# EAGLE design Bluelight (EAGLE 7.6.0)
DESIGNER: J. Gordon

## Sheet 1 of 4: SAMD21
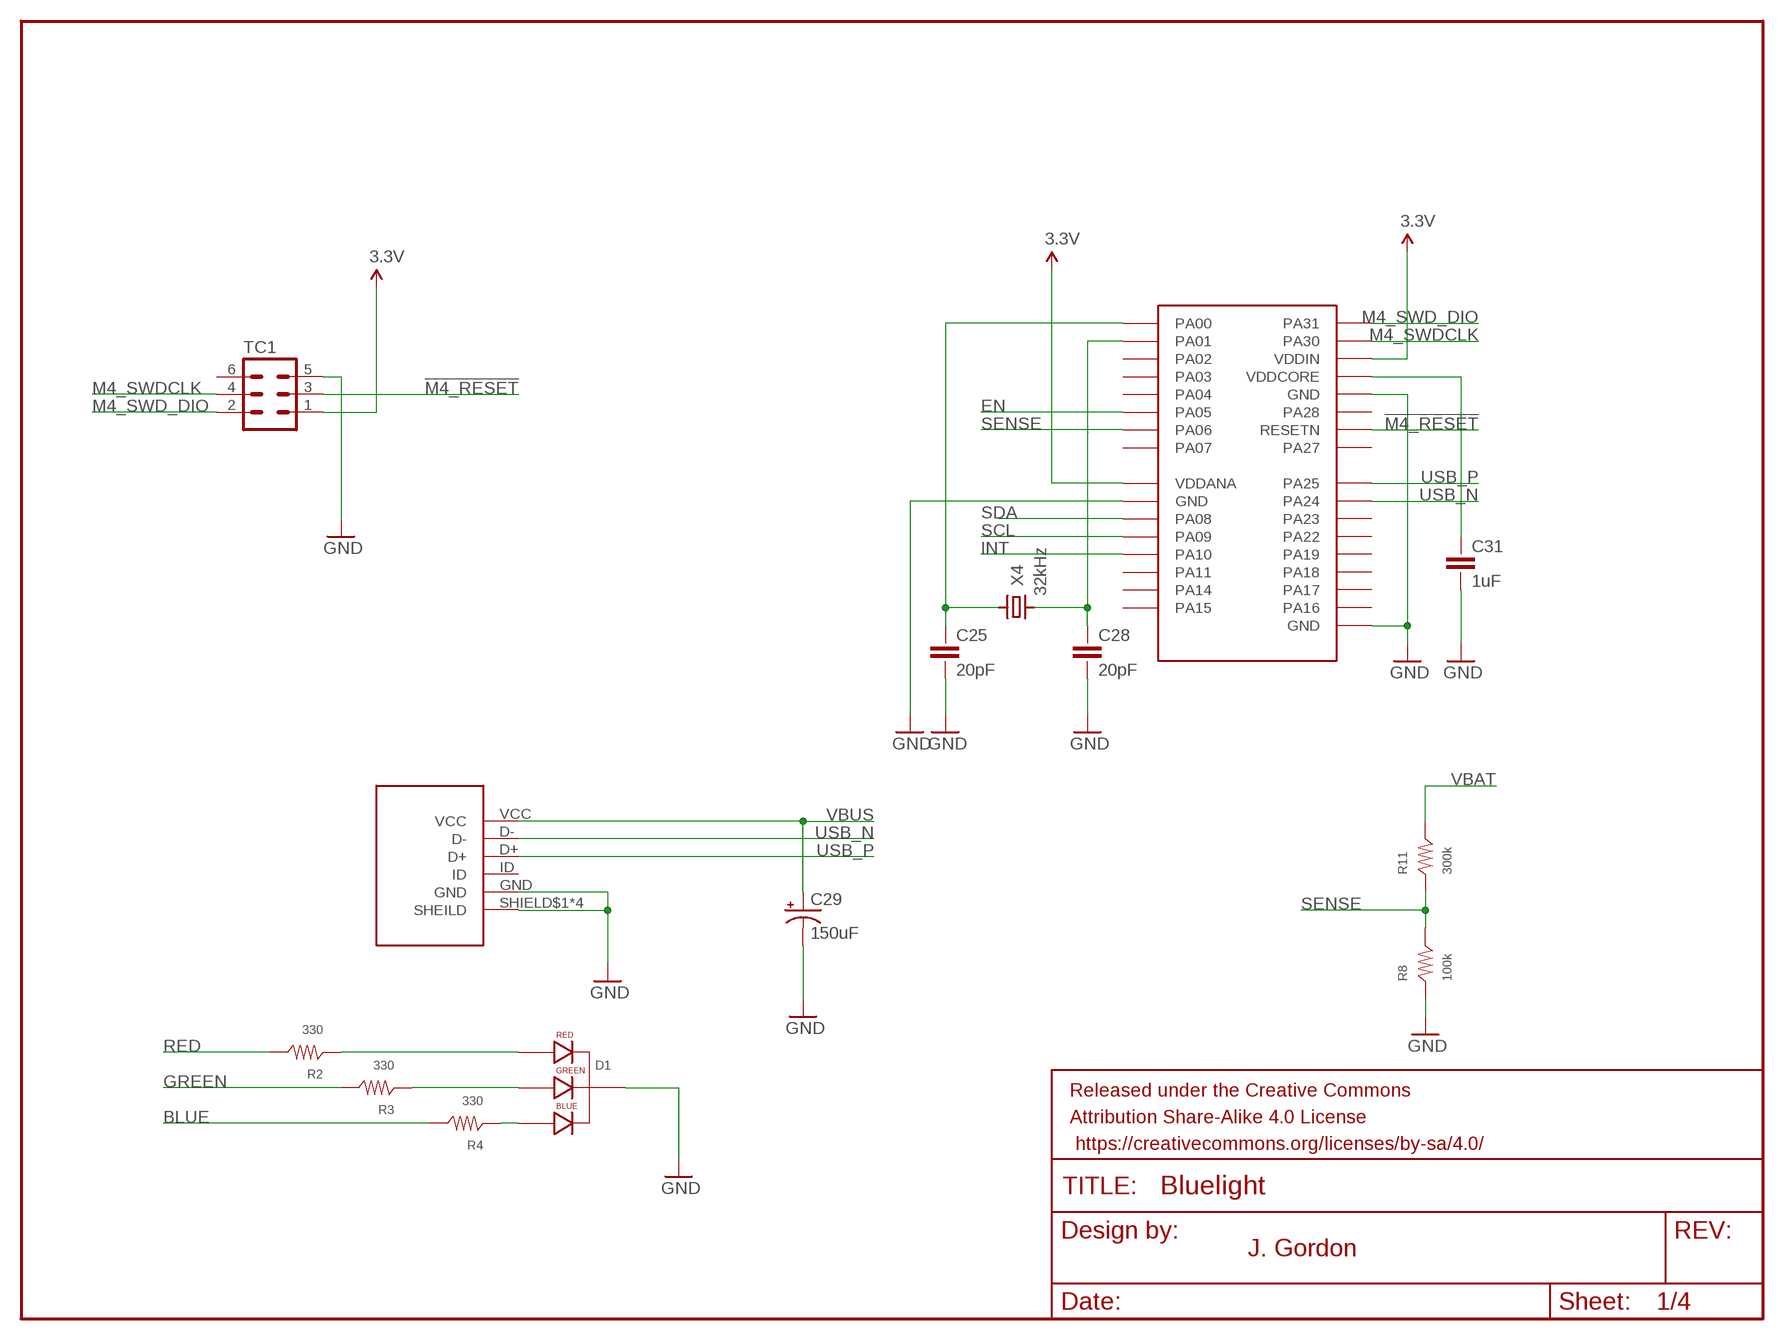
[diagram p0: schematic, sheet 1]

### Parts
C25  20pF  CAP-0402  [CAP-0402]
C28  20pF  CAP-0402  [CAP-0402]
C29  150uF  CAP_POLC  [PANASONIC_C]
C31  1uF  CAP-0402  [CAP-0402]
D1  LED-RGB-CC-THRUDIFFUSE  [LED-RGB-THRU]
FRAME3  FRAME-LETTERNO_PACKAGE  [DUMMY]
J5  10118193-0001LF  [10118193-0001LF]
R2  330  RES-0402  [RES-0402]
R3  330  RES-0402  [RES-0402]
R4  330  RES-0402  [RES-0402]
R8  100k  RES-0402  [RES-0402]
R11  300k  RES-0402  [RES-0402]
TC1  TC2030-IDC-NL  [TC2030-IDC-NL]
U2  ATSAMD21E18A-MUT  [QFN32]
X4  32kHz  CRYSTAL3215  [CRYSTAL-3215]

### Nets
3.3V: TC1.1 U2.9(VDDANA) U2.30(VDDIN) ; also sheet 2,4
!M4_RESET: TC1.3 U2.26(RESETN) ; also sheet 2
BLUE: R4.2 ; also sheet 2
EN: U2.6(PA05) ; also sheet 4
GND: C25.1 C28.1 C29.- C31.1 D1.2(CATHODE) J5.GND J5.SHIELD$1(SHEILD) J5.SHIELD$2(SHEILD) J5.SHIELD$3(SHEILD) J5.SHIELD$4(SHEILD) R8.1 TC1.5 U2.10(GND) U2.28(GND) U2.GND ; also sheet 2,3,4
GREEN: R3.2 ; also sheet 2
INT: U2.13(PA10) ; also sheet 2
M4_SWD_DIO: TC1.2 U2.32(PA31)
M4_SWDCLK: TC1.4 U2.31(PA30)
N$3: D1.4(BLUE_CATHODE) R4.1
N$4: D1.3(GREEN_CATHODE) R3.1
N$9: C28.2 U2.2(PA01) X4.P$1
N$10: D1.1(RED_CATHODE) R2.1
N$17: C25.2 U2.1(PA00) X4.P$2
N$18: C31.2 U2.29(VDDCORE)
RED: R2.2 ; also sheet 2
SCL: U2.12(PA09) ; also sheet 2
SDA: U2.11(PA08) ; also sheet 2
SENSE: R8.2 R11.1 U2.7(PA06)
USB_N: J5.D- U2.23(PA24)
USB_P: J5.D+ U2.24(PA25)
VBAT: R11.2 ; also sheet 4
VBUS: C29.+ J5.VCC ; also sheet 4
Unconnected: J5.ID TC1.6 U2.3(PA02) U2.4(PA03) U2.5(PA04) U2.8(PA07) U2.14(PA11) U2.15(PA14) U2.16(PA15) U2.17(PA16) U2.18(PA17) U2.19(PA18) U2.20(PA19) U2.21(PA22) U2.22(PA23) U2.25(PA27) U2.27(PA28)

### Notes on the sheet
- J. Gordon

## Sheet 2 of 4: nRF51
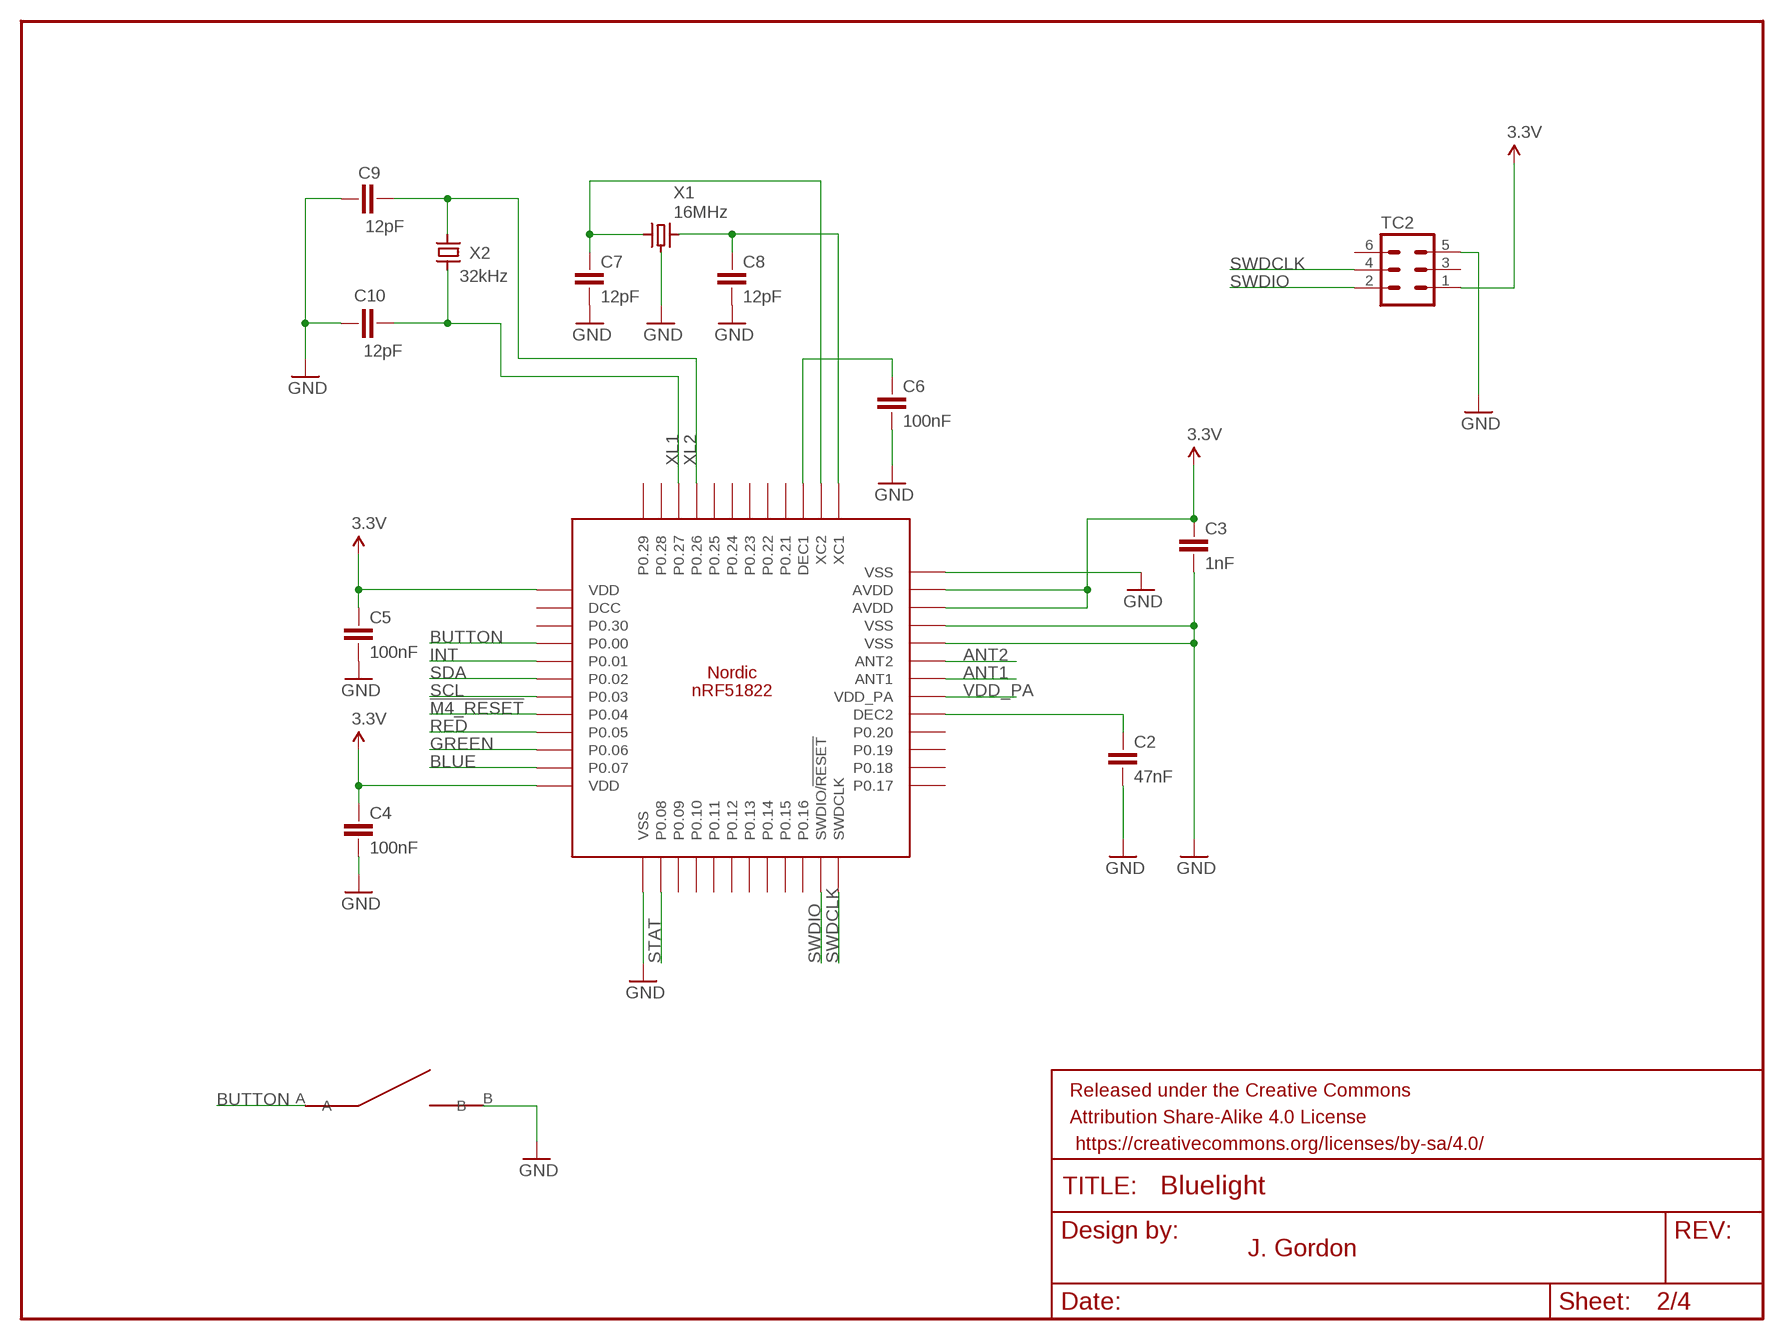
[diagram p1: schematic, sheet 2]

### Parts
C2  47nF  CAP-0402  [CAP-0402]
C3  1nF  CAP-0402  [CAP-0402]
C4  100nF  CAP-0402  [CAP-0402]
C5  100nF  CAP-0402  [CAP-0402]
C6  100nF  CAP-0402  [CAP-0402]
C7  12pF  CAP-0402  [CAP-0402]
C8  12pF  CAP-0402  [CAP-0402]
C9  12pF  CAP-0402  [CAP-0402]
C10  12pF  CAP-0402  [CAP-0402]
FRAME1  FRAME-LETTERNO_PACKAGE  [DUMMY]
TC2  TC2030-IDC-NL  [TC2030-IDC-NL]
U1  NRF51822  [NRF51822]
U$1  EVQ-PF206K  [EVQ-PF206K]
X1  16MHz  CRYSTAL-GND2520  [CRYSTAL-2520]
X2  32kHz  CRYSTAL3215  [CRYSTAL-3215]

### Nets
3.3V: C3.2 C4.2 C5.2 TC2.1 U1.AVDD@1(AVDD) U1.AVDD@2(AVDD) U1.VDD@1(VDD) U1.VDD@2(VDD) ; also sheet 1,4
!M4_RESET: U1.P0.04 ; also sheet 1
ANT1: U1.ANT1 ; also sheet 3
ANT2: U1.ANT2 ; also sheet 3
BLUE: U1.P0.07 ; also sheet 1
BUTTON: U1.P0.00 U$1.A
GND: C2.1 C3.1 C4.1 C5.1 C6.1 C7.1 C8.1 C9.2 C10.2 TC2.5 U1.VSS@1(VSS) U1.VSS@2(VSS) U1.VSS@3(VSS) U1.VSS@4(VSS) U$1.B X1.GND@1(GND) X1.GND@2(GND) ; also sheet 1,3,4
GREEN: U1.P0.06 ; also sheet 1
INT: U1.P0.01 ; also sheet 1
N$1: C2.2 U1.DEC2
N$6: C6.2 U1.DEC1
N$7: C8.2 U1.XC1 X1.3
N$8: C7.2 U1.XC2 X1.1
RED: U1.P0.05 ; also sheet 1
SCL: U1.P0.03 ; also sheet 1
SDA: U1.P0.02 ; also sheet 1
STAT: U1.P0.08 ; also sheet 4
SWDCLK: TC2.4 U1.SWDCLK
SWDIO: TC2.2 U1.SWDIO/!RESET
VDD_PA: U1.VDD_PA ; also sheet 3
XL1: C10.1 U1.P0.27 X2.P$1
XL2: C9.1 U1.P0.26 X2.P$2
Unconnected: TC2.3 TC2.6 U1.DCC U1.P0.09 U1.P0.10 U1.P0.11 U1.P0.12 U1.P0.13 U1.P0.14 U1.P0.15 U1.P0.16 U1.P0.17 U1.P0.18 U1.P0.19 U1.P0.20 U1.P0.21 U1.P0.22 U1.P0.23 U1.P0.24 U1.P0.25 U1.P0.28 U1.P0.29 U1.P0.30

### Notes on the sheet
- J. Gordon

## Sheet 3 of 4: Antenna
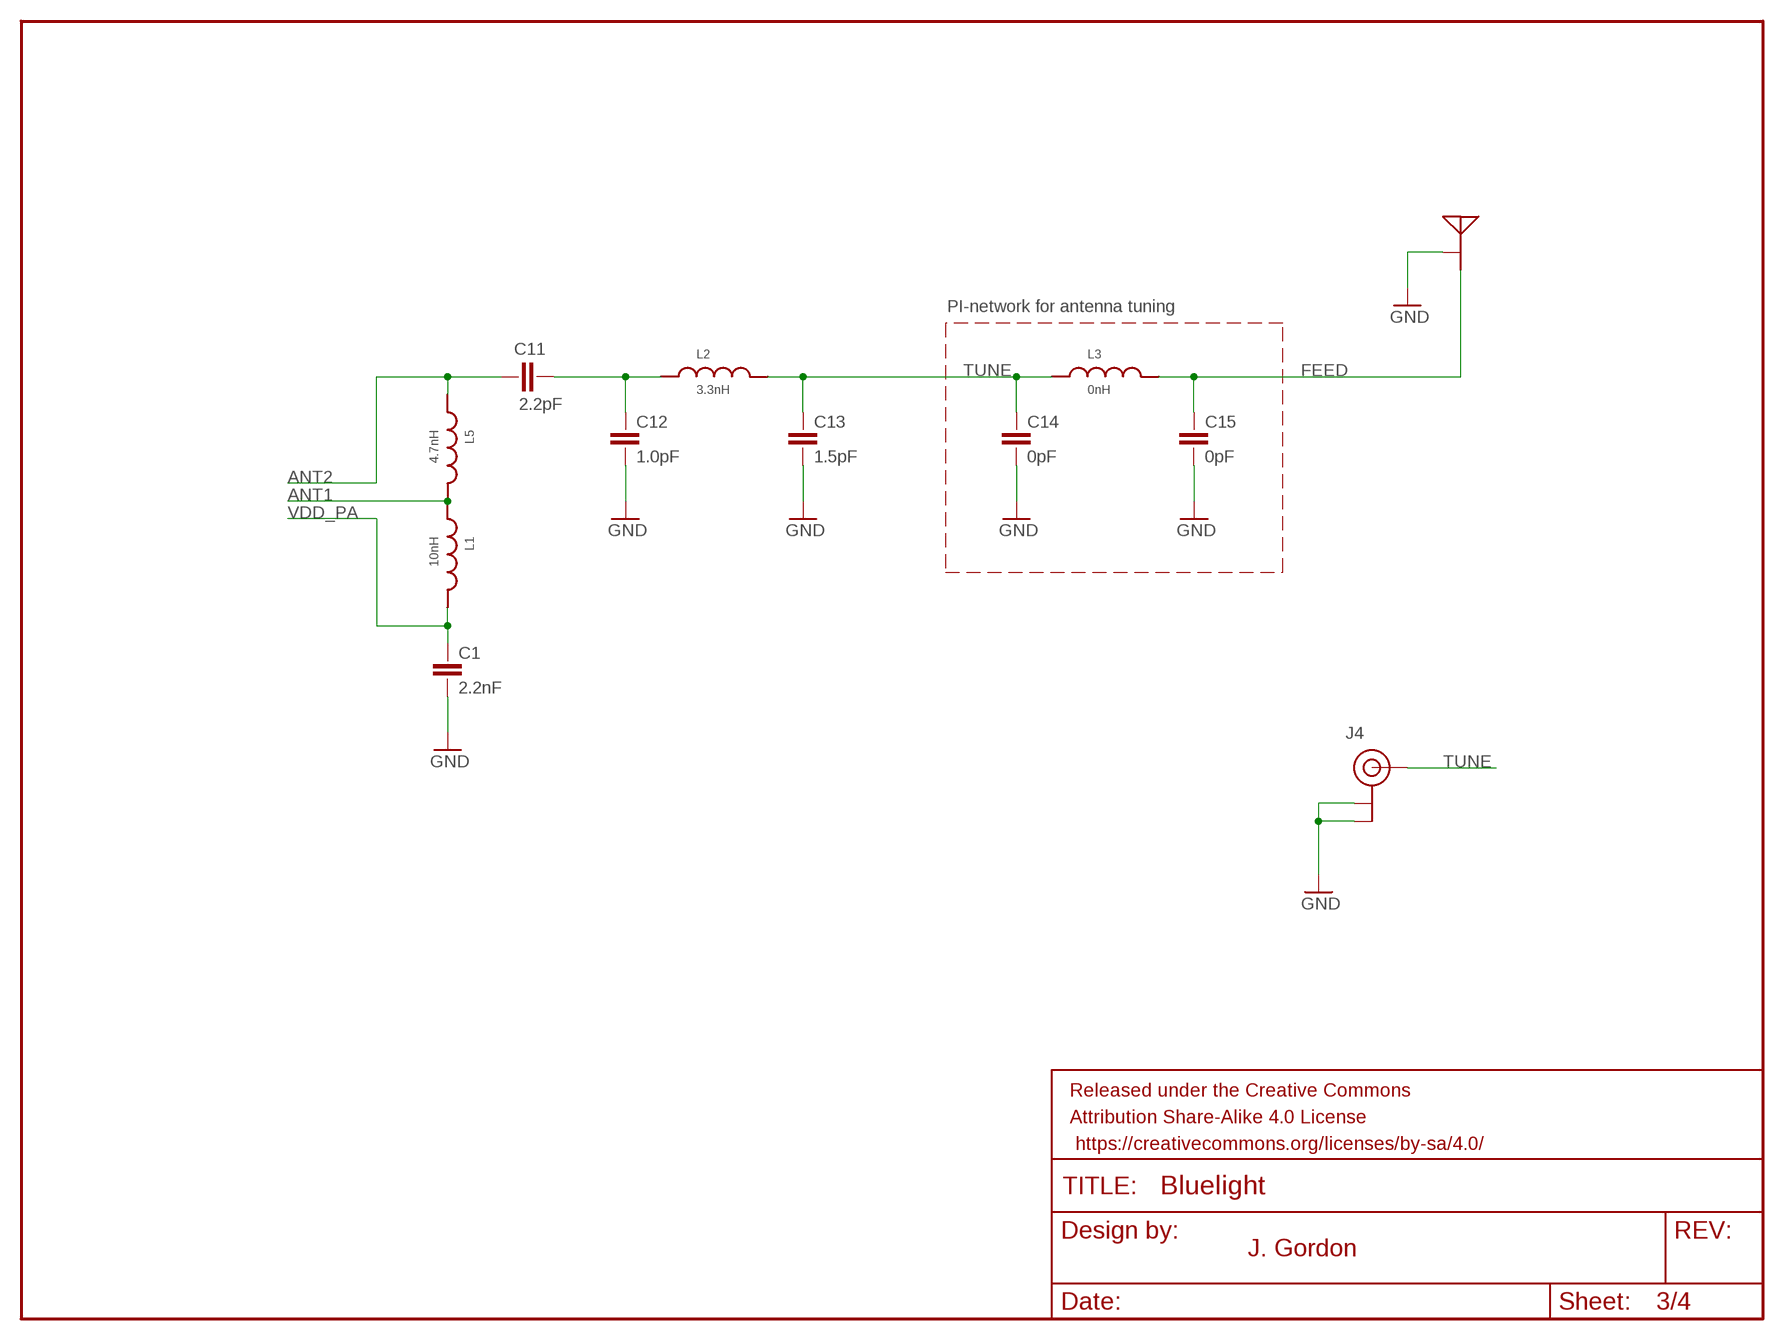
[diagram p2: schematic, sheet 3]

### Parts
ANT1  MEANDER-ANT  [MEANDER-ANT]
C1  2.2nF  CAP-0402  [CAP-0402]
C11  2.2pF  CAP-0402  [CAP-0402]
C12  1.0pF  CAP-0402  [CAP-0402]
C13  1.5pF  CAP-0402  [CAP-0402]
C14  0pF  CAP-0402  [CAP-0402]
C15  0pF  CAP-0402  [CAP-0402]
FRAME2  FRAME-LETTERNO_PACKAGE  [DUMMY]
J4  U.FL  [U.FL]
L1  10nH  IND-0402  [IND-0402]
L2  3.3nH  IND-0402  [IND-0402]
L3  0nH  IND-0402  [IND-0402]
L5  4.7nH  IND-0402  [IND-0402]

### Nets
ANT1: L1.1 L5.2 ; also sheet 2
ANT2: C11.2 L5.1 ; also sheet 2
FEED: ANT1.FEED C15.2 L3.2
GND: ANT1.GND C1.1 C12.1 C13.1 C14.1 C15.1 J4.P$1(GND) J4.P$2(GND) ; also sheet 1,2,4
N$5: C11.1 C12.2 L2.1
TUNE: C13.2 C14.2 J4.P$3(SIGNAL) L2.2 L3.1
VDD_PA: C1.2 L1.2 ; also sheet 2

### Notes on the sheet
- PI-network for antenna tuning
- J. Gordon

## Sheet 4 of 4: Power
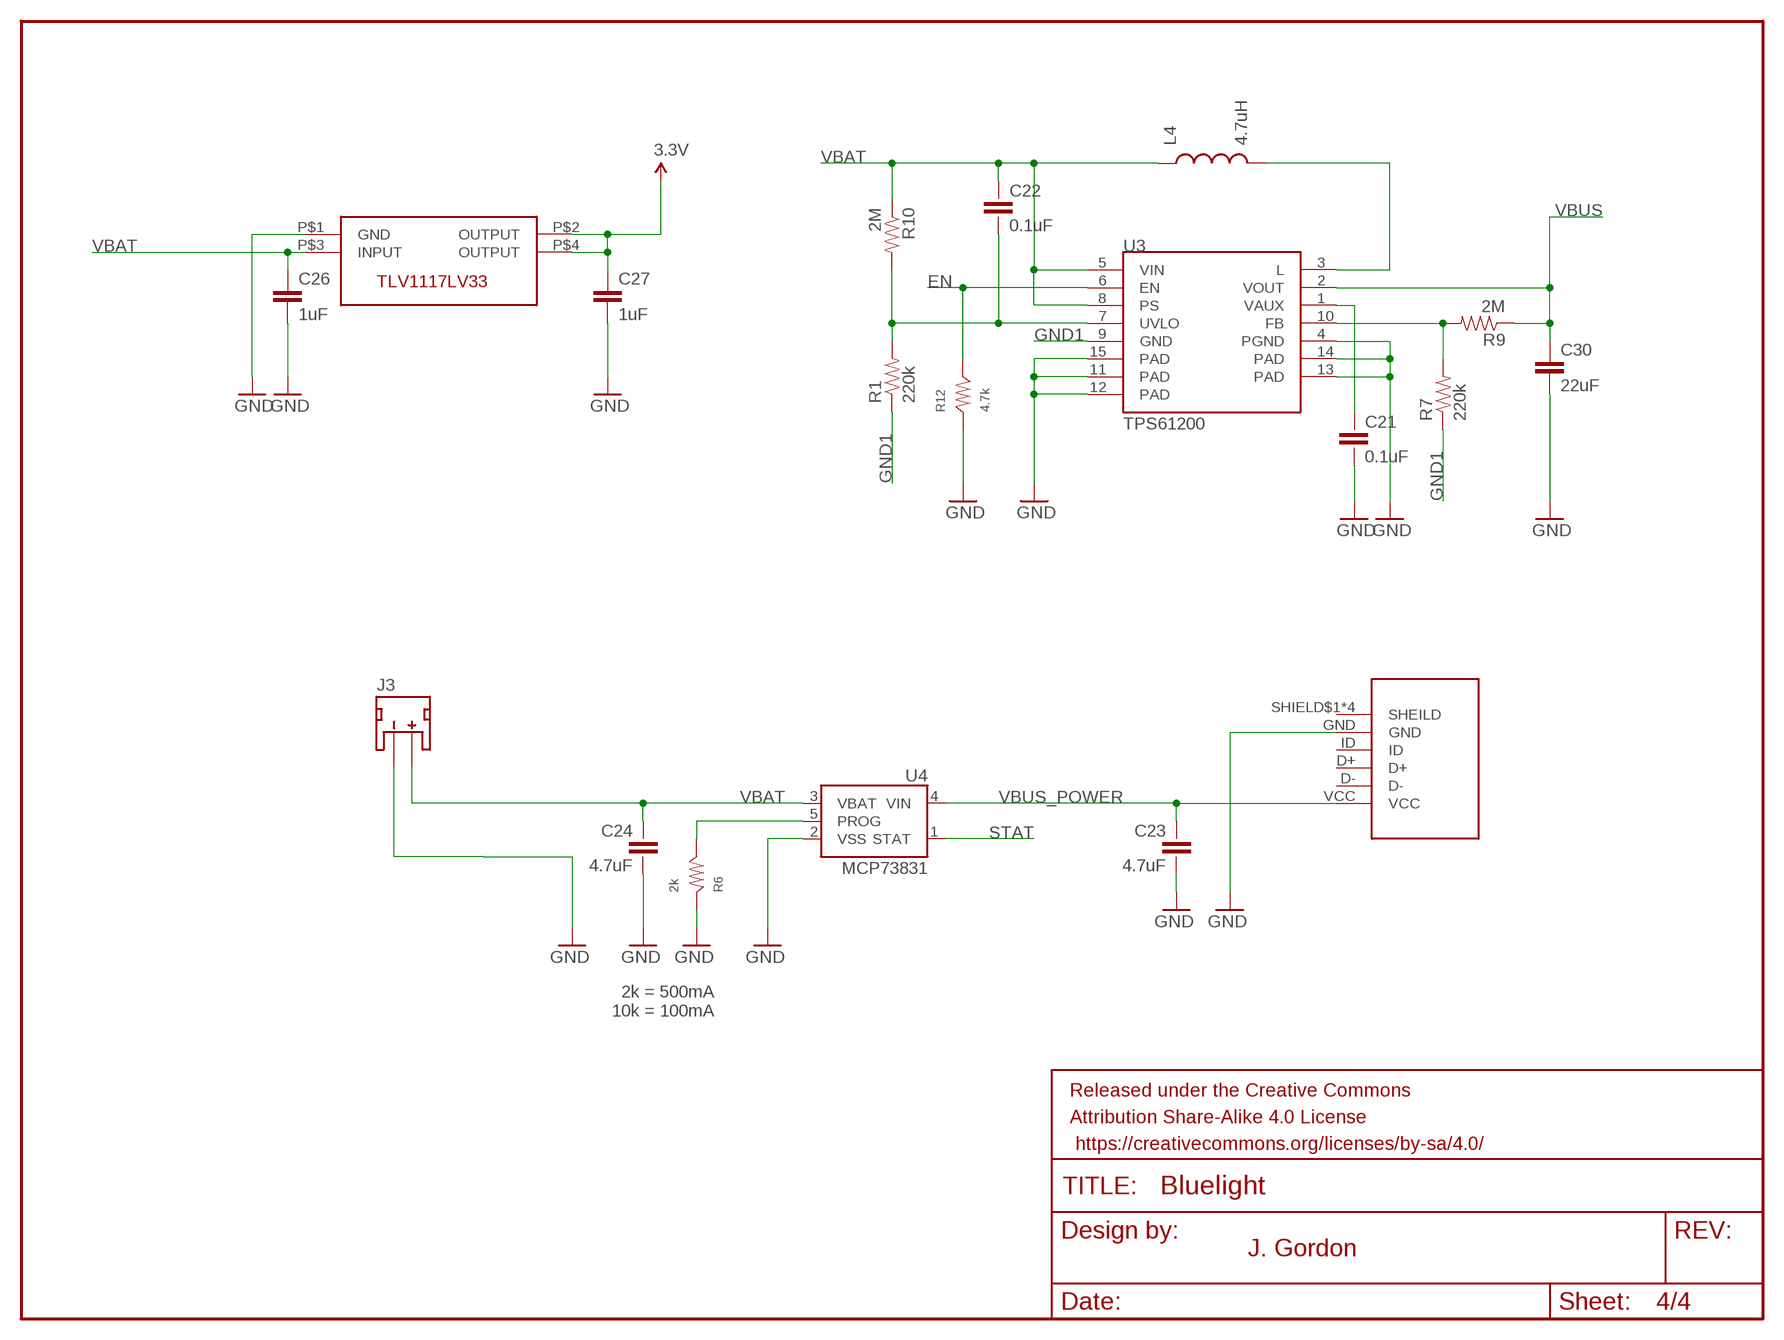
[diagram p3: schematic, sheet 4]

### Parts
C21  0.1uF  CAP-0402  [CAP-0402]
C22  0.1uF  CAP-0402  [CAP-0402]
C23  4.7uF  CAP-0402  [CAP-0402]
C24  4.7uF  CAP-0402  [CAP-0402]
C26  1uF  CAP0805  [0805]
C27  1uF  CAP0805  [0805]
C30  22uF  CAP1206  [1206]
FRAME4  FRAME-LETTERNO_PACKAGE  [DUMMY]
J1  10118193-0001LF  [10118193-0001LF]
J3  JST-2  JST_2MM_MALE  [JST-2-SMD]
L4  4.7uH  INDUCTOR.  [CDRH2D09]
R1  220k  RESISTOR0805-RES  [0805]
R6  2k  RES-0402  [RES-0402]
R7  220k  RESISTOR0805-RES  [0805]
R9  2M  RESISTOR0805-RES  [0805]
R10  2M  RESISTOR0805-RES  [0805]
R12  4.7k  RES-0402  [RES-0402]
U3  TPS61200  [QFN-10_PAD]
U4  MCP73831  [SOT23-5]
U5  TLV1117LV33  [TLV1117LV33]

### Nets
3.3V: C27.1 U5.P$2(OUTPUT) U5.P$4(OUTPUT) ; also sheet 1,2
EN: R12.2 U3.6(EN) ; also sheet 1
GND: C21.1 C23.1 C24.1 C26.2 C27.2 C30.2 J1.GND J3.1(-) R6.1 R12.1 U3.4(PGND) U3.11(PAD) U3.12(PAD) U3.13(PAD) U3.14(PAD) U3.15(PAD) U4.2(VSS) U5.P$1(GND) ; also sheet 1,2,3
GND1: R1.1 R7.1 U3.9(GND)
N$12: L4.P$2 U3.3(L)
N$14: C21.2 U3.1(VAUX)
N$15: R7.2 R9.2 U3.10(FB)
N$16: C22.1 R1.2 R10.2 U3.7(UVLO)
PROG: R6.2 U4.5(PROG)
STAT: U4.1(STAT) ; also sheet 2
VBAT: C22.2 C24.2 C26.1 J3.2(+) L4.P$1 R10.1 U3.5(VIN) U3.8(PS) U4.3(VBAT) U5.P$3(INPUT) ; also sheet 1
VBUS: C30.1 R9.1 U3.2(VOUT) ; also sheet 1
VBUS_POWER: C23.2 J1.VCC U4.4(VIN)
Unconnected: J1.D+ J1.D- J1.ID J1.SHIELD$1(SHEILD) J1.SHIELD$2(SHEILD) J1.SHIELD$3(SHEILD) J1.SHIELD$4(SHEILD) J3.NC1(PAD1) J3.NC2(PAD2)

### Notes on the sheet
- 2k = 500mA
  10k = 100mA
- J. Gordon

## Library data of the parts
ANT1 = Nordic:MEANDER-ANT
C1-C15 C23-C25 C28 = Nordic:CAP-0402
C21 C22 C31 = Passives:CAP-0402
C26 C27 = SparkFun-Capacitors:CAP: Capacitor Standard 0603 ceramic capacitor, and 0.1" leaded capacitor.
C29 = SparkFun-Capacitors:CAP_POL: Capacitor Polarized These are standard SMD and PTH capacitors. Normally 10uF, 47uF, and 100uF in electrolytic and tantalum varieties. Always verify the external diameter of the through hole cap, it varies with capacity, voltage, and manufacturer. The EIA devices should be standard.
C30 = SparkFun-Passives:CAP: Capacitor Standard 0603 ceramic capacitor, and 0.1" leaded capacitor.
D1 = SparkFun-LED:LED-RGB-CC-THRU: RGB Through-hole common cathode LED SparkFun Storefront: COM-00105 (Clear) COM-09264 (Diffuse); PROD_ID: DIO-09434
FRAME1-FRAME4 = SparkFun-Aesthetics:FRAME-LETTER: Schematic Frame Standard 8.5x11 US Letter frame; DESIGNER: Nobody; VERSION: v01
J1 J5 = 10118193-0001LF:10118193-0001LF
J3 = SparkFun-Connectors:JST_2MM_MALE: Mates to single-cell LiPo batteries. CONN-11443 Now with smashable polarity marks!; BTM_NEG: -; BTM_POS: +; PROD_ID: CONN-11443; TOP_NEG: -; TOP_POS: +
J4 = SparkFun-Connectors:U.FL: SMD antenna connector- WRL-09144; PROD_ID: CONN-09193
L1-L3 L5 = Nordic:IND-0402
L4 = SparkFun-Passives:INDUCTOR: Inductors Basic Inductor/Choke - 0603 and 1206. Footprints are not proven and vary greatly between part numbers. INDUCTOR POWER 3.3UH 4.0A SMD 0.197" L x 0.197" W x 0.177" H (5.00mm x 5.00mm x 4.50mm)
R1 R7 R9 R10 = SparkFun-Passives:RESISTOR: Resistor Basic schematic elements and footprints for 0603, 1206, and PTH resistors.
R2-R4 R8 R11 R12 = Passives:RES-0402
R6 = Nordic:RES-0402
TC1 TC2 = TagConnect:TC2030-IDC: Tag-Connect In Circuit Programming & Debug Cable 6 Pin http://www.tag-connect.com
U1 = Nordic:NRF51822
U2 = atmel-samd21:ATSAMD21E18A-MUT: This is the ATMEL SAMD21E QFN-32. ATSAMD21E18A
U3 = SparkFun-PowerIC:TPS61200: DC to DC Booster IC-10035; PROD_ID: IC-10035
U4 = SparkFun-PowerIC:MCP73831: Miniature single cell, fully integrated Li-Ion, Li-polymer charge management controller http://ww1.microchip.com/downloads/en/DeviceDoc/21984a.pdf IC-09995; PROD_ID: IC-09995
U5 = TLV1117LV33:TLV1117LV33
U$1 = EVQ-PF206K:EVQ-PF206K
X1 = Nordic:CRYSTAL-GND
X2 X4 = Nordic:CRYSTAL

## Board
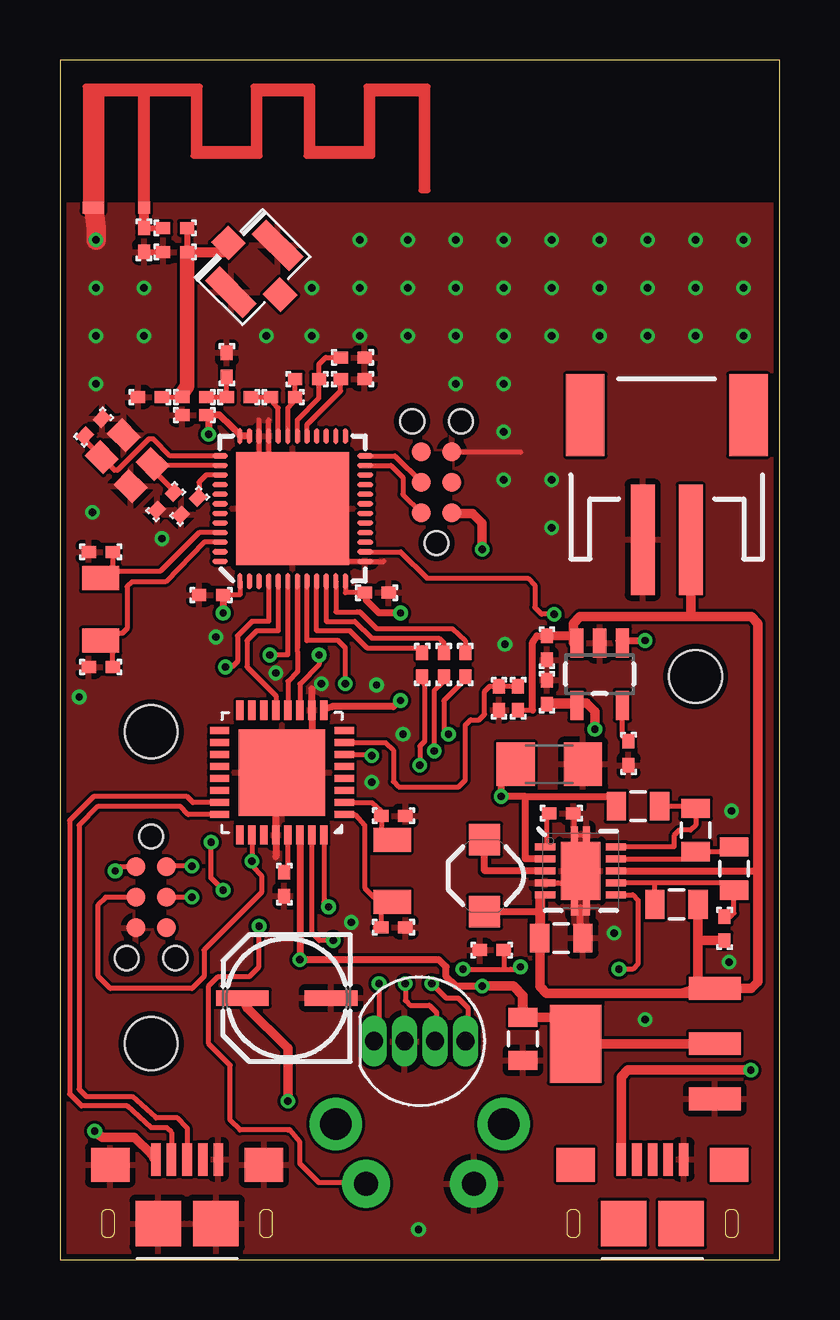
[diagram p4: board, top side]
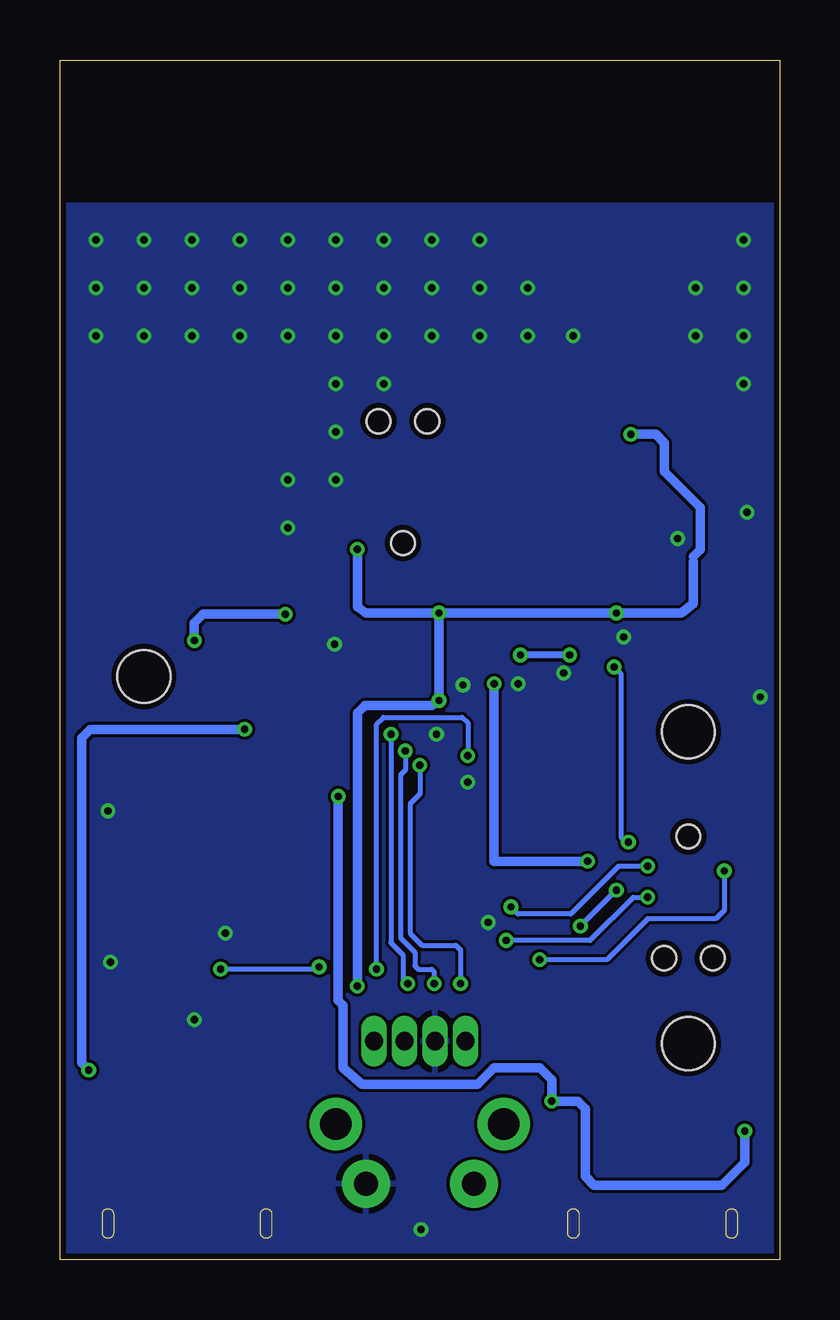
[diagram p5: board, bottom side, seen from below]

Size 30 x 50 mm. Coordinates in mm from the lower left corner, seen from the top.
Outline: 0,0 30,0 30,50 0,50 0,0
Copper layers (1*16): Top 0.035mm / dielectric 1.5mm / Bottom 0.035mm
Design rules "dirt_cheap_dirty_boards.v1 *": minimum track width 5mil, minimum drill 12mil, track to track 5mil, track to pad 5mil, pad to pad 5mil, via to via 5mil, smd to smd 0mil, copper to edge 10mil, drill to drill 10mil, minimum pad ring 6mil, minimum via ring 6mil, stop-mask expansion 2mil, vias tented up to drill 25mil, thermal gap 10mil
Holes 2.2 mm at 3.8,22 26.5,24.3 3.8,9
tRestrict: area 0,44.2 to 30,50.5
bRestrict: area 0,44.2 to 29.9,50.5

### Footprints (pad centres in the part's own frame; a part is rotated, then mirrored left to right if it is on the bottom)
MEANDER-ANT = smd 0.5 x 0.5: FEED 2.55,-0.25 | smd 0.9 x 0.5: GND 0.45,-0.25
CAP-0402 = smd 0.6 x 0.5: 1 -0.5,0; 2 0.5,0
0805 = smd 0.8 x 1.2: 1 -0.9,0; 2 0.9,0
PANASONIC_C = smd 2.2 x 0.65: + 1.9,-0.2; - -1.8,-0.2
1206 = smd 1.6 x 1.8: 1 -1.4,0; 2 1.4,0
LED-RGB-THRU = drill 0.762 pad 0.889 long: 1 1.905,0; 2 0.635,0; 3 -0.635,0; 4 -1.905,0
10118193-0001LF = smd 0.4 x 1.35: D+ 0,2.675; D- -0.65,2.675; GND 1.3,2.675; ID 0.65,2.675; VCC -1.3,2.675 | smd 1.6 x 1.4: SHIELD$1 -3.2,2.45; SHIELD$2 3.2,2.45 | smd 1.9 x 1.9: SHIELD$3 -1.2,0; SHIELD$4 1.2,0
JST-2-SMD = smd 1 x 4.6: 1 -1,-3.7; 2 1,-3.7 | smd 1.6 x 3.4: NC1 -3.4,1.5; NC2 3.4,1.5
U.FL = smd 2.2 x 0.85: P$1 0,1.375; P$2 0,-1.375 | smd 1.05 x 1: P$3 1.525,0; P$4 -1.525,0
IND-0402 = smd 0.6 x 0.5: 1 -0.5,0; 2 0.5,0
CDRH2D09 = smd 1.3 x 1.3: P$1 -1.5,0; P$2 1.5,0
RES-0402 = smd 0.6 x 0.5: 1 -0.5,0; 2 0.5,0
TC2030-IDC-NL = smd 0.787 x 0.787: 1 -1.27,-0.635; 2 -1.27,0.635; 3 0,-0.635; 4 0,0.635; 5 1.27,-0.635; 6 1.27,0.635 | hole 0.991: -2.54,0; 2.54,1.016; 2.54,-1.016
NRF51822 = smd 0.65 x 0.2: ANT1 3.025,0.2; ANT2 3.025,0.6; AVDD@1 3.025,1.8; AVDD@2 3.025,2.2; DCC -3.025,1.8; DEC2 3.025,-0.6; P0.00 -3.025,1; P0.01 -3.025,0.6; P0.02 -3.025,0.2; P0.03 -3.025,-0.2; P0.04 -3.025,-0.6; P0.05 -3.025,-1; P0.06 -3.025,-1.4; P0.07 -3.025,-1.8; P0.17 3.025,-2.2; P0.18 3.025,-1.8; P0.19 3.025,-1.4; P0.20 3.025,-1; P0.30 -3.025,1.4; VDD@1 -3.025,2.2; VDD@2 -3.025,-2.2; VDD_PA 3.025,-0.2; VSS@2 3.025,1; VSS@3 3.025,1.4 | smd 0.2 x 0.65: DEC1 1.4,3.025; P0.08 -1.8,-3.025; P0.09 -1.4,-3.025; P0.10 -1,-3.025; P0.11 -0.6,-3.025; P0.12 -0.2,-3.025; P0.13 0.2,-3.025; P0.14 0.6,-3.025; P0.15 1,-3.025; P0.16 1.4,-3.025; P0.21 1,3.025; P0.22 0.6,3.025; P0.23 0.2,3.025; P0.24 -0.2,3.025; P0.25 -0.6,3.025; P0.26 -1,3.025; P0.27 -1.4,3.025; P0.28 -1.8,3.025; P0.29 -2.2,3.025; SWDCLK 2.2,-3.025; SWDIO/!RESET 1.8,-3.025; VSS@1 -2.2,-3.025; XC1 2.2,3.025; XC2 1.8,3.025 | smd 4.7 x 4.7: VSS@4 0,0
QFN32 = smd 0.8 x 0.3: 1 -2.6,1.75; 2 -2.6,1.25; 3 -2.6,0.75; 4 -2.6,0.25; 5 -2.6,-0.25; 6 -2.6,-0.75; 7 -2.6,-1.25; 8 -2.6,-1.75; 17 2.6,-1.75; 18 2.6,-1.25; 19 2.6,-0.75; 20 2.6,-0.25; 21 2.6,0.25; 22 2.6,0.75; 23 2.6,1.25; 24 2.6,1.75 | smd 0.3 x 0.8: 9 -1.75,-2.6; 10 -1.25,-2.6; 11 -0.75,-2.6; 12 -0.25,-2.6; 13 0.25,-2.6; 14 0.75,-2.6; 15 1.25,-2.6; 16 1.75,-2.6; 25 1.75,2.6; 26 1.25,2.6; 27 0.75,2.6; 28 0.25,2.6; 29 -0.25,2.6; 30 -0.75,2.6; 31 -1.25,2.6; 32 -1.75,2.6 | smd 3.6 x 3.6: GND 0,0
QFN-10_PAD = smd 0.297 x 0.85: 1 -1,-1.475; 2 -0.5,-1.475; 3 0,-1.475; 4 0.5,-1.475; 5 1,-1.475; 6 1,1.475; 7 0.5,1.475; 8 0,1.475; 9 -0.5,1.475; 10 -1,1.475 | smd 0.7 x 0.28: 11 -1.5,0.25; 12 -1.5,-0.25; 13 1.5,0.25; 14 1.5,-0.25 | smd 2.4 x 1.65: 15 0,0
SOT23-5 = smd 0.55 x 1.2: 1 -0.95,-1.3; 2 0,-1.3; 3 0.95,-1.3; 4 0.95,1.3; 5 -0.95,1.3
TLV1117LV33 = smd 0.95 x 2.15: P$1 -2.3,0; P$2 0,0; P$3 2.3,0 | smd 3.25 x 2.15: P$4 0,5.8
EVQ-PF206K = drill 1 pad 2: A -2.25,-1.25; B 2.25,-1.25 | drill 1.3 pad 2.2: P$1 -3.5,1.25; P$2 3.5,1.25
CRYSTAL-2520 = smd 1.1 x 0.9: 1 -0.85,-0.65; 3 0.85,0.65; GND@1 -0.85,0.65; GND@2 0.85,-0.65
CRYSTAL-3215 = smd 1 x 1.55: P$1 -1.3,0; P$2 1.3,0

### Placement (x,y rotation side)
ANT1  0.95,44.1 0 top
C1  12.2,37.6 180 top
C2  12.2,36.7 180 top
C3  13.2,27.8 180 top
C4  5.6,35.2 0 top
C5  6.3,27.7 0 top
C6  5.4,31.4 45 top
C7  4.4,31.6 45 top
C8  1.4,34.7 225 top
C9  1.7,29.5 180 top
C10  1.7,24.7 180 top
C11  7.45,35.95 0 top
C12  6.95,37.3 270 top
C13  3.75,35.95 0 top
C14  4.8,42 0 top
C15  3.5,42.5 90 top
C21  20.9,18.6 180 top
C22  27.7,13.8 270 top
C23  20.3,23.65 270 top
C24  20.3,25.5 90 top
C25  13.9,13.85 180 top
C26  20.9,13.4 0 top
C27  19.3,9.2 270 top
C28  13.9,18.5 180 top
C29  9.5,10.7 180 top
C30  20.4,20.65 0 top
C31  9.35,15.65 90 top
D1  15,9.1 180 top
FRAME1  0,0 0 top
FRAME2  0,0 0 top
FRAME3  0,0 0 top
FRAME4  0,0 0 top
J1  24.7,1.5 0 top
J3  25.3,33.7 0 top
J4  8.1,41.3 135 top
J5  5.3,1.5 0 top
L1  10.3,36.7 0 top
L2  5.6,35.95 180 top
L3  4.8,43 180 top
L4  17.7,16 90 top
L5  9.3,35.95 0 top
R1  28.1,16.3 270 top
R2  15.1,24.8 90 top
R3  16,24.8 90 top
R4  16.9,24.8 90 top
R6  23.7,21.1 90 top
R7  26.5,17.9 90 top
R8  18.3,23.4 90 top
R9  24.1,18.9 0 top
R10  25.7,14.8 180 top
R11  19.1,23.4 270 top
R12  18,12.9 0 top
TC1  3.8,15.1 270 top
TC2  15.7,32.4 90 top
U1  9.7,31.3 90 top
U2  9.25,20.3 180 top
U3  21.7,16.2 270 top
U4  22.5,24.4 180 top
U5  27.3,9 90 top
U$1  15,4.4 0 top
X1  2.8,33.3 135 top
X2  1.7,27.1 90 top
X4  13.85,16.2 270 top

### Tracks (layer width: path | path; a pad name or v marks a point on that pad's centre or on a via)
3.3V  (via drill 0.3)
  Top 0.2: U1.AVDD@1 7.8,34.33 | C4.2 6.2,35.1 | U1.VDD@1 7.5,27.7 C5.2 | 16.36,31.1 TC2.1 | U1.VDD@2 11.9,27.8 C3.2 | TC1.1 2.47,16.37 v2.3,16.2
  Top 0.3: 7.8,34.33 7.58,34.33 | 6.2,35.1 v6.2,34.4 | U1.AVDD@2 7.58,34.33 | 7.58,34.33 6.7,35.15 6.65,35.2 C4.2 | C5.2 v6.8,26.95 | v17.6,11.4 16.5,11.4 16.1,11.8 16.1,12.2 15.8,12.5 v10,12.5 U2.30 | 20.8,10.1 20.8,9.7 | v14.2,26.95 13.3,26.95 12.8,27.45 C3.2 | v14.2,23.3 14.2,23.35 13.9,23.05 11.35,23.05 U2.9
  Top 0.4: v17.6,29.6 17.6,30.7 17.2,31.1 16.36,31.1 | U5.P$2 U5.P$4 20.9,8.1 20.8,9.7 20.9,8.6 20.7,8.9 20.7,9.6 | v17.6,11.4 18.9,11.4 19.3,11 | C27.1 20.8,10.1
  Top 0.406: C27.1 19.3,11
  Bottom 0.2: v2.3,16.2 2.3,14.56 2.66,14.2 5.5,14.2 7.2,12.5 v10,12.5
  Bottom 0.3: 3.6,29.1 3.6,29.3
  Bottom 0.4: v6.2,34.4 5.16,34.4 4.8,34.04 4.8,32.85 3.3,31.35 3.3,29.6 3.6,29.3 | 3.6,29.1 3.6,27.35 4.1,26.95 v6.8,26.95 v14.2,26.95 | v14.2,26.95 17.25,26.95 17.6,27.2 v17.6,29.6 | v14.2,26.95 v14.2,23.3 14.5,23.1 17,23.1 17.28,23.1 17.6,22.78 v17.6,11.4
!M4_RESET  (via drill 0.3)
  Top 0.2: U1.P0.04 10.3,25.8 11.6,25.8 11.9,25.5 v11.9,24 | U2.26 v8,16.6 8,16.4 8.4,16 8.4,15.3 6,12.9 6,11.8 5.5,11.3 2.1,11.3 1.6,11.8 1.6,14.8 1.9,15.1 TC1.3
  Bottom 0.4: v8,16.6 11.9,16.6 v11.9,24
ANT1
  Top 0.2: U1.ANT1 9.5,35.5 9.7,35.7 9.7,35.8 L5.2 L1.1
ANT2
  Top 0.2: U1.ANT2 9.1,35.5 8.9,35.7 8.9,35.8 L5.1 C11.2
BLUE
  Top 0.2: U1.P0.07 11.5,27 12.4,27 12.5,27 13.2,26.3 16.36,26.3 16.9,25.8 R4.2
BUTTON  (via drill 0.3)
  Top 0.2: U$1.A 11.85,3.2 10.8,3.2 10,4 10,4.9 9.6,5.4 9.5,5.4 7.5,5.4 7.1,5.8 7.1,8.1 6.2,9 6.2,11.4 6.6,11.8 7.9,11.8 8.3,12.2 v8.3,13.9 | v6.8,15.4 6.3,15.9 v6.3,17.4 | U1.P0.00 8.7,26.6 8,26.6 7.4,26 7.4,24.92 7.18,24.7 v6.9,24.7
  Bottom 0.2: v8.3,13.9 v6.8,15.4 | v6.3,17.4 6.4,17.4 6.6,17.6 6.6,24.4 v6.9,24.7
EN  (via drill 0.3)
  Top 0.2: U3.6 23.88,15.2 24.1,14.98 24.1,12.32 23.88,12.1 v23.3,12.1 | 11.85,21 U2.6 13,21.05 v13,21 | v16.8,12.1 18.5,12.1 | 18.5,12.1 18.8,12.1 19.1,12.1 v19.2,12.2 | v19.2,12.2 19.2,12.3 v19.2,12.2 | R12.2 18.5,12.1
  Bottom 0.2: v16.8,12.1 16.8,22.32 16.52,22.6 13.22,22.6 13,22.38 v13,21 | v19.2,12.2 19.3,12.1 v23.3,12.1
FEED
  Top 0.254: 3.45,43 L3.2
  Top 0.406: 3.45,43 C15.2 ANT1.FEED
GND  (via drill 0.3)
  Top 0.2: U1.VSS@2 8.7,32.3 U1.VSS@4 11.9,29.1 U1.VSS@1 13.5,29.1 | U1.VSS@2 8.7,33.28 8.54,33.12 8.54,33.16 8.3,33.4 U1.VSS@3 8.3,35 | U3.12 21.45,18.55 C21.1 | U3.12 21.45,16.45 U3.15 | U3.4 21.2,15.7 | 21.2,15.7 U3.15 | 21.2,15.7 21.45,15.45 U3.14 21.7,14.7 | 22.2,16.7 U3.15 | 21.7,14.7 21.7,14.5 | TC2.5 19.18,33.67 19.2,33.65 | 9,19.6 9.25,19.6 U2.GND 9.25,20.1 10.5,20.1 | U1.VSS@2 8.7,35 | U3.12 U3.11 | 21.7,14.7 U3.13
  Top 0.254: C15.1 C14.1
  Top 0.3: C26.2 21.7,13.7 21.7,14.5 | 10.5,20.1 U2.10 10.5,23.8 | 9,19.6 U2.28 9,16.8
  Top 0.813: ANT1.GND 1.5,43 v1.5,42.5
  other vias: 8.6,38.5 1.35,31.15 4.25,30.05 28,18.7 13,19.9 14.95,1.25 23.1,13.6 24.4,10 6.5,25.95 18.55,25.65 27.9,12.4 12.5,42.5 14.5,42.5 16.5,42.5 18.5,42.5 20.5,42.5 22.5,42.5 24.5,42.5 26.5,42.5 28.5,42.5 12.5,40.5 14.5,40.5 16.5,40.5 18.5,40.5 20.5,40.5 22.5,40.5 24.5,40.5 26.5,40.5 28.5,40.5 10.5,40.5 12.5,38.5 14.5,38.5 16.5,38.5 18.5,38.5 20.5,38.5 22.5,38.5 24.5,38.5 26.5,38.5 28.5,38.5 10.5,38.5 3.5,40.5 1.5,40.5 1.5,38.5 3.5,38.5 16.5,36.5 18.5,36.5 18.5,34.5 18.5,32.5 20.5,32.5 20.5,30.5 1.5,36.5 12.15,14.05 13.2,23.95 9,24.45 10.9,24 0.8,23.45 14.3,21.9
  pour Bottom: 0,50 30,50 30,0 0,0
  pour Top: 0,50 30,50 30,0 0,0
GND1
  Top 0.2: U3.9 26.6,16.7 R7.1 28,17 R1.1
GREEN
  Top 0.2: U1.P0.06 11.1,26.6 12.3,26.6 13,25.9 15.3,25.9 15.8,25.9 16,25.7 R3.2
INT
  Top 0.2: U1.P0.01 9.1,26.2 8.2,26.2 7.8,25.8 7.8,24.7 9,23.5 U2.13
M4_SWD_DIO  (via drill 0.3)
  Top 0.2: U2.32 11,14.9 v11.2,14.7 | v5.5,16.4 4.46,16.4 TC1.2
  Bottom 0.2: v5.5,16.4 6.7,16.4 8.7,14.4 10.9,14.4 v11.2,14.7
M4_SWDCLK  (via drill 0.3)
  Top 0.2: v11.4,13.3 10.82,13.3 10.5,13.62 U2.31 | v5.5,15.1 TC1.4
  Bottom 0.2: v11.4,13.3 7.9,13.3 6.1,15.1 v5.5,15.1
N$1
  Top 0.2: U1.DEC2 10.3,34.8 11.7,36.2 C2.2
N$3  (via drill 0.3)
  Top 0.2: R4.1 16.9,24.2 16,23.3 16,21.9 v16.2,21.9 | v15.5,11.5 15.5,11.4 15.6,11.4 16.1,10.9 16.6,10.9 17,10.5 17,9.3 | 17,9.3 D1.4 17,9.3
  Bottom 0.2: v16.2,21.9 16.2,13.2 15.7,12.7 15.7,11.5 v15.5,11.5
N$4  (via drill 0.3)
  Top 0.2: R3.1 16,24.1 15.6,23.7 v15.6,21.2 | v14.4,11.5 14.4,10.8 14.6,10.6 15.4,10.6 15.7,10.3 15.7,9.23 D1.3
  Bottom 0.2: v15.6,21.2 15.6,20.4 15.8,20.2 15.8,17.4 15.8,13.4 15.7,13.3 15.2,12.8 15.2,12.24 15.06,12.1 14.5,12.1 14.4,12 v14.4,11.5
N$5
  Top 0.2: L2.1 C11.1 C12.2
N$6
  Top 0.2: U1.DEC1 6.1,32.7 5.8,32.4 5.8,31.8 C6.2
N$7
  Top 0.2: U1.XC1 4.6,33.5 3.9,34.2 3.7,34.2 2.4,32.9 2.28,32.9 X1.3 1.05,34.13 C8.2
N$8
  Top 0.2: U1.XC2 3.86,33.1 X1.1 4.1,32.92 4.1,32.7 4.55,32.25 C7.2
N$9
  Top 0.2: X4.P$1 13.35,17.5 13.4,17.55 C28.2 13.4,18.7 13,19.05 U2.2
N$10  (via drill 0.3)
  Top 0.2: R2.1 15.1,24.1 15.2,23.9 15.2,21.6 15,21.4 v15,20.6 | v13.3,11.5 13.3,9.3 | 13.3,9.3 | 13.3,9.3 13.2,9.21 D1.1
  Bottom 0.2: v15,20.6 15,19.4 15.4,19 15.4,17.4 15.4,17.3 15.4,14.9 15.4,13.6 14.9,13.1 13.5,13.1 13.3,12.9 v13.3,11.5
N$12
  Top 0.3: U3.3 18.8,16.2 17.7,16.2 L4.P$2
N$14
  Top 0.2: U3.1 20.3,17.2 20.3,18.5 C21.2
N$15
  Top 0.2: U3.10 25.6,17.2 25.6,17.68 25.82,17.9 26.3,17.9 26.5,18.1 R7.2 26.5,18.9 R9.2
N$16
  Top 0.2: 24.8,15.7 28,15.7 R1.2 28.1,14.44 27.96,14.3 C22.1 | 24.8,15.7 U3.7 | R10.2 24.8,15.7
N$17
  Top 0.2: 13.15,13.8 13.15,13.85 C25.2 13.4,14.45 | 13.4,14.45 X4.P$2 | U2.1 12.3,18.55 12.7,18.1 12.7,15.5 13.1,15.1 13.4,15.1 13.4,14.45
N$18
  Top 0.2: C31.2 9.5,16.4 U2.29
PROG
  Top 0.2: R6.2 23.45,21.8 U4.5
RED
  Top 0.2: U1.P0.05 10.7,26.2 12.1,26.2 12.8,25.5 15,25.5 R2.2
SCL
  Top 0.2: 9.9,25.5 9.9,25.35 9.9,24.52 9.91,24.51 9.5,24.1 U2.12 | 9.9,25.5 U1.P0.03 9.9,25.5
SDA  (via drill 0.3)
  Top 0.2: U1.P0.02 9.5,25.3 9.5,25.2 8.85,25.2 v8.75,25.2 | v10.8,25.2 10.8,24.8 10,24 U2.11
  Bottom 0.3: v8.75,25.2 v10.8,25.2
SENSE
  Top 0.2: U2.7 13.58,21.55 13.9,21.23 13.9,19.92 14.12,19.7 16.62,19.7 16.9,19.98 16.9,22.28 17.12,22.5 17.48,22.5 17.7,22.72 17.7,23.68 17.92,23.9 R8.2 R11.1
STAT  (via drill 0.3)
  Top 0.2: U4.1 23.35,25.8 23.3,25.8 23.4,25.8 | v20.6,26.9 20.08,26.9 19.8,27.18 19.8,28.1 19.5,28.4 15.3,28.4 14.2,29.5 U1.P0.08
  Top 0.3: 23.3,25.8 23.4,25.8 v24.4,25.8
  Bottom 0.4: v24.4,25.8 24.4,26.54 24.04,26.9 v20.6,26.9
SWDCLK
  Top 0.2: U1.SWDCLK 13.96,33.5 TC2.4
SWDIO
  Top 0.2: 14.79,31.2 TC2.2 14.3,31.89 14.3,32.6 13.8,33.1 U1.SWDIO/!RESET
TUNE
  Top 0.2: L2.2 C13.2 5.1,35.9 5.1,36.1
  Top 0.254: L3.1 C14.2
  Top 0.406: C14.2 7.02,42 J4.P$3
  Top 0.6: C14.2 5.3,36.4 5.1,36.1
USB_N
  Top 0.2: U2.23 5.55,19.05 5.3,19.3 1.4,19.3 0.4,18.3 0.4,6.9 0.9,6.4 2.8,6.4 3.8,5.5 4.45,5.5 4.65,5.3 J5.D-
USB_P
  Top 0.2: U2.24 5.35,18.55 5,18.9 1.6,18.9 0.8,18.1 0.8,7.1 1.1,6.8 3,6.8 4,5.9 4.9,5.9 5.3,5.5 J5.D+
VBAT
  Top 0.2: 21.4,26 U4.3 21.4,25.65 | 26.6,29.2 J3.2 | 19.1,23.1 R11.2 19.3,22.9 19.7,22.9
  Top 0.3: 20,14.5 L4.P$1 | U3.8 29.1,16.2 | 19.7,22.9 19.7,25.72 19.88,26 C24.2 | U3.5 20,15.1
  Top 0.4: 21.4,26 C24.2 | 25.9,11.1 26.6,11.3 U5.P$3 28.82,11.3 29.1,11.58 29.1,16.2 29.1,26.52 28.82,26.8 26.3,26.8 | 25.9,11.1 26.6,11.1 26.6,13.3 | 26.6,13.3 R10.1 26.6,13.3 | 26.6,13.3 C22.2 | U4.3 21.4,25.7 21.4,26.52 21.68,26.8 26.3,26.8 | 26.3,26.8 26.3,28.9 26.4,29 26.6,29.2 | C26.1 20,11.38 20.28,11.1 25.9,11.1
  Top 0.406: 20,15.1 20,14.5 C26.1
VBUS  (via drill 0.3)
  Top 0.3: U3.2 19.4,16.7 19.4,19.3 | 19.4,19.3 v18.4,19.3 18.4,20.4 C30.1 | 19.4,19.3 22.9,19.3 R9.1 | 3.9,4.25 3.8,4.4
  Top 0.4: 3.8,4.4 3.1,5.1 1.75,5.1 v1.45,5.35 | v9.5,6.6 9.5,8.8 7.8,10.5 C29.+ | 3.9,4.25 4,4.25 J5.VCC
  Bottom 0.4: v18.4,19.3 18.4,10.8 18.2,10.6 18.2,8 17.4,7.3 12.6,7.3 11.9,8 10,8 9.5,7.5 v9.5,6.6 8.42,6.6 8.1,6.28 8.1,3.46 7.74,3.1 2.4,3.1 1.45,4.05 v1.45,5.35
VBUS_POWER  (via drill 0.3)
  Top 0.2: 21.4,23.15 U4.4
  Top 0.4: 21.4,23.15 C23.2 20.4,23.2 21.94,23.2 22.3,22.84 v22.3,22.1 | J1.VCC 23.4,7.62 23.68,7.9 v28.8,7.9
  Bottom 0.4: v28.8,7.9 29.1,8.2 29.1,21.74 28.74,22.1 v22.3,22.1
VDD_PA
  Top 0.2: U1.VDD_PA 9.9,35 10.8,35.9 L1.2 10.8,37.32 11.08,37.6 C1.2
XL1
  Top 0.2: U1.P0.27 6,29.9 4.4,28.25 3,28.25 2.8,28.05 2.8,26.3 2.6,26.1 2,26.1 X2.P$1 2.2,25.3 C10.1
XL2
  Top 0.2: U1.P0.26 5.8,30.3 4.2,28.7 2.4,28.7 2.2,28.9 | C9.1 2.2,28.9 | 2.2,28.9 X2.P$2